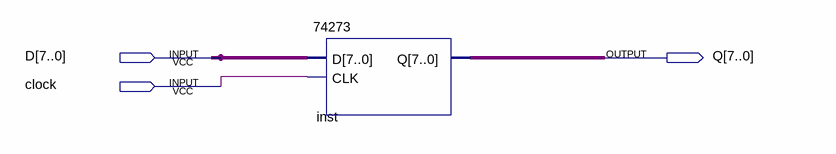
[diagram p0: schematic sheet]
// Quartus schematic Reg80317.bdf as structural Verilog: 1 symbols, 3 pins
module Reg80317 (
  input  [7:0] D,
  input  clock,
  output [7:0] Q
);

  \74273  inst (.D(D), .CLK(clock), .Q(Q));
endmodule
